# Altium schematic sheet YA-N-Power_Supply.SchDoc: Yet Another IoT Node - Power
size A4; Revision: 1.0; SheetNumber: 2; SheetTotal: 5
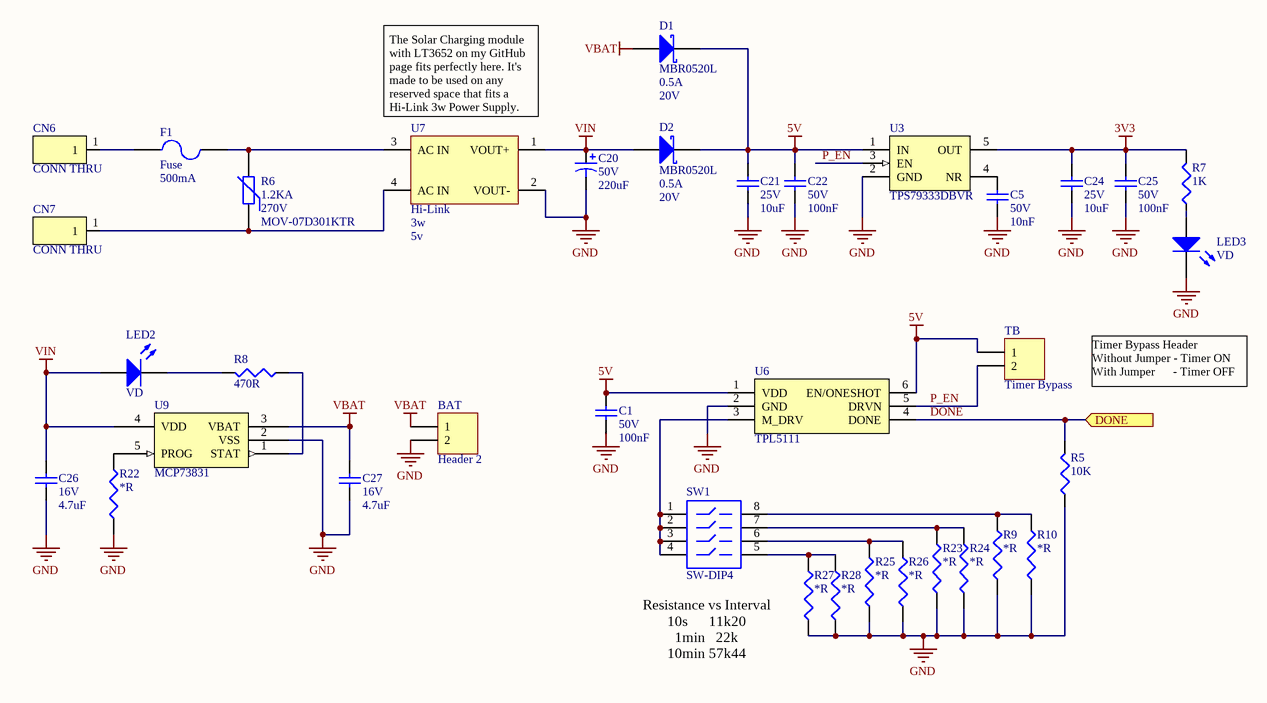
[diagram p0: YA-N-Power_Supply.SchDoc]

## Parts
BAT  Header 2  [CONN XH2.54 - 2]
C1  value 100nF  Tensão: 50V  [CC0603]  (hidden comment: Capacitor Cerâmico)
C5  value 10nF  Tensão: 50V  [CC0603]  (hidden comment: Capacitor Cerâmico)
C20  value 220uF  Tensão: 50V  [CPOLRAD10X20]  (hidden comment: Capacitor Aluminio)
C21  value 10uF  Tensão: 25V  [CC0805]  (hidden comment: Capacitor Cerâmico)
C22  value 100nF  Tensão: 50V  [CC0603]  (hidden comment: Capacitor Cerâmico)
C24  value 10uF  Tensão: 25V  [CC0805]  (hidden comment: Capacitor Cerâmico)
C25  value 100nF  Tensão: 50V  [CC0603]  (hidden comment: Capacitor Cerâmico)
C26  value 4.7uF  Tensão: 16V  [CC0805]  (hidden comment: Capacitor Cerâmico)
C27  value 4.7uF  Tensão: 16V  [CC0805]  (hidden comment: Capacitor Cerâmico)
CN6  CONN THRU  [CONN THRU]
CN7  CONN THRU  [CONN THRU]
D1  MBR0520L  Corrente: 0.5A  Tensão: 20V  [SOD-123F]
D2  MBR0520L  Corrente: 0.5A  Tensão: 20V  [SOD-123F]
F1  Fuse  Corrente: 500mA  [BLOCKFUS_4X8]
LED2  value VD  [LED 0603]  (hidden comment: LED)
LED3  value VD  [LED 0603]  (hidden comment: LED)
R5  value 10K  [CC0603]  (hidden comment: Resistor)
R6  value 270V  Corrente: 1.2KA  Obs: MOV-07D301KTR  [DISCFUS7]  (hidden comment: Varistor)
R7  value 1K  [CC0603]  (hidden comment: Resistor)
R8  value 470R  [CC0603]  (hidden comment: Resistor)
R9  value *R  [CC0603]  (hidden comment: Resistor)
R10  value *R  [CC0603]  (hidden comment: Resistor)
R22  value *R  [CC0603]  (hidden comment: Resistor)
R23  value *R  [CC0603]  (hidden comment: Resistor)
R24  value *R  [CC0603]  (hidden comment: Resistor)
R25  value *R  [CC0603]  (hidden comment: Resistor)
R26  value *R  [CC0603]  (hidden comment: Resistor)
R27  value *R  [CC0603]  (hidden comment: Resistor)
R28  value *R  [CC0603]  (hidden comment: Resistor)
SW1  SW-DIP4  [SWITCH-DIP8]
TB  Timer Bypass  [CONN HDR1X2]
U3  TPS79333DBVR  [SOT-23-5N]
U6  TPL5111  [TSOT-23-6N]
U7  Hi-Link  Potência: 3w  Tensão: 5v  [Fonte-HILINK]
U9  MCP73831  [SOT-23-5N]

## Ports
DONE (in)

## Nets
3V3: C24.2 C25.2 R7.2 U3.5(OUT)
5V: C1.2 C21.2 C22.2 D1.2(K) D2.2(K) TB.1 U3.1(IN) U6.1(VDD) U6.6(EN/ONESHOT)
GND: BAT.2 C1.1 C5.1 C20.2 C21.1 C22.1 C24.1 C25.1 C26.1 C27.1 LED3.2(K) R5.1 R9.1 R10.1 R22.1 R23.1 R24.1 R25.1 R26.1 R27.1 R28.1 U3.2(GND) U6.2(GND) U7.2(VOUT-) U9.2(VSS)
VBAT: BAT.1 C27.2 D1.1(A) U9.3(VBAT)
VIN: C20.1 C26.2 D2.1(A) LED2.1(A) U7.1(VOUT+) U9.4(VDD)
DONE: R5.2 U6.4(DONE) ; port DONE
P_EN: TB.2 U3.3(EN) U6.5(DRVN)
NetC5_2: C5.2 U3.4(NR)
NetCN6_1: CN6.1 F1.1
NetCN7_1: CN7.1 R6.1 U7.4(AC_IN)
NetF1_2: F1.2 R6.2 U7.3(AC_IN)
NetLED2_2: LED2.2(K) R8.2
NetLED3_1: LED3.1(A) R7.1
NetR8_1: R8.1 U9.1(STAT)
NetR9_2: R9.2 R10.2 SW1.8
NetR22_2: R22.2 U9.5(PROG)
NetR23_2: R23.2 R24.2 SW1.7
NetR25_2: R25.2 R26.2 SW1.6
NetR27_2: R27.2 R28.2 SW1.5
NetSW1_1: SW1.1 SW1.2 SW1.3 SW1.4 U6.3(M_DRV)

## Notes on the sheet
- (near U7) The Solar Charging module with LT3652 on my GitHub page fits perfectly here. It's made to be used on any reserved space that fits a Hi-Link 3w Power Supply.
- Timer Bypass Header
  Without Jumper - Timer ON
  With Jumper      - Timer OFF
- Resistance vs Interval
  10s      11k20
  1min   22k
  10min 57k44
- Projeto:
- Tamanho:
- Data:
- A4
- Eng. Felipe Navarro
- Hora:
- Revisão:
- Folha
- de
- Arquivo:

## Library data of the parts
BAT TB = Header 2: Header, 2-Pin; ChinesePrice: 0,10000; Chinês: Proved - Local; Value: Barra de 40 pinos - ATENÇÃO; Corrente: *; Potência: *; Supplier 1: Digi-Key; Supplier Part Number 1: A26509-40-ND; Tensão: *; Obs:: *; Tolerância: *; ComponentLink1Description: Datasheet; ComponentLink1URL: D:\Tecnoclade\Datasheet\!DataMissing.pdf
C1 C22 C25 = Cap 100nF 50V 0603 X7R: Capacitor (Semiconductor SIM Model); Chinês: Local; ChinesePrice: 0,00250; Corrente: *A; Potência: *W; Obs:: X7R; Tolerância: ±10%; Supplier 1: Digi-Key; Supplier Part Number 1: 1276-1000-1-ND; ComponentLink1Description: Datasheet; ComponentLink1URL: D:\Tecnoclade\Datasheet\!DataMissing.pdf
C5 = Cap 10nF 50V 0603 X7R 5%: Capacitor (Semiconductor SIM Model); Chinês: Local; ChinesePrice: 0,00320; Corrente: *A; Potência: *W; Obs:: X7R; Tolerância: ±5%; Supplier 1: Digi-Key; Supplier Part Number 1: 399-1092-1-ND; ComponentLink1Description: Datasheet; ComponentLink1URL: D:\Tecnoclade\Datasheet\!DataMissing.pdf
C20 = PCap 220uF 50V CPOLRAD10X20 LOESR: Polarized Capacitor; ChinesePrice: 0,00000; Chinês: -----; Corrente: 970mA (Ripple); Potência: *W; Obs: LOESR (0R19); Tolerância: ±20%; Supplier 1: Digi-Key; Supplier Part Number 1: 565-3452-ND; ComponentLink1Description: Datasheet; ComponentLink1URL: D:\Tecnoclade\Datasheet\Capacitor e_PZA.pdf
C21 C24 = Cap 10uF 25V 0805 X5R: Capacitor (Semiconductor SIM Model); Chinês: Local; ChinesePrice: 0,02620; Corrente: *A; Potência: *W; Obs:: X5R; Tolerância: ±10%; Supplier 1: Digi-Key; Supplier Part Number 1: 587-2985-1-ND; ComponentLink1Description: Datasheet; ComponentLink1URL: D:\Tecnoclade\Datasheet\!DataMissing.pdf
C26 C27 = Cap 4.7uF 16V 0805 X5R: Capacitor (Semiconductor SIM Model); Chinês: Local; ChinesePrice: 0,01480; Corrente: *A; Potência: *W; Obs:: X5R; Tolerância: ±10%; Supplier 1: Digi-Key; Supplier Part Number 1: 1276-1065-1-ND; ComponentLink1Description: Datasheet; ComponentLink1URL: D:\Tecnoclade\Datasheet\!DataMissing.pdf
CN6 CN7 = CONN THRU: Chinês: Proved - Local; Corrente: *; Potência: *; Supplier 1: Digi-Key; Supplier Part Number 1: --Not; Tensão: *; Obs:: *; Tolerância: *; ComponentLink1Description: Datasheet; ComponentLink1URL: D:\Tecnoclade\Datasheet\!DataMissing.pdf
D1 D2 = DS 20V 0.5A 385mV SOD-123: Schottky Diode; ChinesePrice: 0,00000; Chinês: ----; Value: Vf=385mV@500mA; Obs:: Fast Recovery =< 500ns, > 200mA (Io); Potência: *; Supplier 1: Digi-Key; Supplier Part Number 1: MBR0520L-TPMSCT-ND; Tolerância: *; ComponentLink1Description: Datasheet; ComponentLink1URL: D:\Tecnoclade\Datasheet\!DataMissing.pdf
F1 = Fuse Disc: ChinesePrice: 0,00000; Chinês: ----; Tensão: 250v; Potência: *; Supplier 1: Digi-Key; Supplier Part Number 1: 507-1173-ND; Value: *; Obs:: *; Tolerância: *; ComponentLink1Description: Datasheet; ComponentLink1URL: D:\Tecnoclade\Datasheet\
LED2 LED3 = LED 0603 VD 2V 75mW: ChinesePrice: 0,02810; Chinês: Local; Corrente: 20mA; Potência: 75mW; Tensão: 2V; Obs:: 35mcd@130º; Supplier 1: Digi-Key; Supplier Part Number 1: 160-1478-1-ND; Tolerância: *; ComponentLink1Description: Datasheet; ComponentLink1URL: D:\Tecnoclade\Datasheet\!DataMissing.pdf
R5 = Res 10K 1% 0603 1/10W: ChinesePrice: 0,00089; Chinês: Local; Corrente: *A; Potência: 1/10W; Tensão: *V; Tolerância: ±1%; Supplier 1: Digi-Key; Supplier Part Number 1: P10.0KHCT-ND; Obs: *; ComponentLink1Description: Datasheet; ComponentLink1URL: D:\Tecnoclade\Datasheet\!DataMissing.pdf
R6 = Var 270V 1.2KA Disc7mm: Varistor (Voltage-Sensitive Resistor); ChinesePrice: 0,00000; Chinês: ----; Potência: 20J; Tensão: 190Vac / 250Vdc; Tolerância: ±*%; Supplier 1: Digi-Key; Supplier Part Number 1: MOV-07D301KCT-ND; ComponentLink1Description: Datasheet; ComponentLink1URL: D:\Tecnoclade\Datasheet\!DataMissing.pdf
R7 = Res 1K 1% 0603 1/10W: ChinesePrice: 0,00089; Chinês: Local; Corrente: *A; Potência: 1/10W; Tensão: *V; Tolerância: ±1%; Supplier 1: Digi-Key; Supplier Part Number 1: RMCF0603FT1K00CT-ND; Obs: *; ComponentLink1Description: Datasheet; ComponentLink1URL: D:\Tecnoclade\Datasheet\!DataMissing.pdf
R8 = Res 470R 5% 0603 1/10W: ChinesePrice: 0,00000; Chinês: ----; Corrente: *A; Potência: 1/10W; Tensão: *V; Obs: ±200ppm/ºC; Tolerância: ±5%; Supplier 1: Digi-Key; Supplier Part Number 1: RMCF0603JT470RCT-ND; ComponentLink1Description: Datasheet; ComponentLink1URL: D:\Tecnoclade\Datasheet\!DataMissing.pdf
R9 R10 R22-R28 = Res - $Val $% $Footprint $Pot: ChinesePrice: 0,00000; Chinês: ----; Corrente: *A; Potência: 1/10W; Tensão: *V; Tolerância: ±*%; Supplier 1: Digi-Key; Supplier Part Number 1: --Del; Obs:: *; ComponentLink1Description: Datasheet; ComponentLink1URL: D:\Tecnoclade\Datasheet\!DataMissing.pdf
SW1 = SW-DIP4: 4009 Series DIP Switch, Raised actuator; Value: SPST; ChinesePrice: 0,00000; Chinês: ----; Corrente: *; Potência: *; Supplier 1: Digi-Key; Supplier Part Number 1: --Del; Tensão: *; Obs:: *; Tolerância: *; ComponentLink1Description: Datasheet; ComponentLink1URL: D:\Tecnoclade\Datasheet\
U3 = TPS79333: ULTRALOW-NOISE, HIGH PSRR, FAST RF 200mA LOW-DROPOUT LINEAR  REGULATORS I; Tensão: 3V3; ChinesePrice: 0,00000; Chinês: ----; Corrente: 200mA; Potência: *; Supplier 1: Digi-Key; Supplier Part Number 1: 296-12961-1-ND; Value: *; Obs:: *; Tolerância: *; ComponentLink1Description: Datasheet; ComponentLink1URL: D:\Tecnoclade\Datasheet\
U6 = TPL5111: Nano-Power System Timer for Power Gating; Chinês: Local; Corrente: *; Potência: *; Supplier 1: Digi-Key; Supplier Part Number 1: 296-42621-1-ND; Tensão: *; Obs:: *; Tolerância: *; ComponentLink1Description: Datasheet; ComponentLink1URL: D:\Tecnoclade\Datasheet\!DataMissing.pdf
U7 = Fonte Hi-Link: Fonte chaveada isolada; ChinesePrice: 0,00000; Chinês: ----; Corrente: 4; Supplier 1: Digi-Key; Value: *; Obs:: *; Tolerância: *; ComponentLink1Description: Datasheet; ComponentLink1URL: D:\Tecnoclade\Datasheet\IE1212S.pdf
U9 = MCP73832/1: Miniature Single-Cell, Fully Integrated Li-Ion, Li-Polymer Charge Management Controllers; ChinesePrice: 0,00000; Chinês: ----; Tensão: Vdd=3V75 ~ 6V; Value: Vchrg=4V2 ~ 4V5; Corrente: 500mA; Obs:: 73831=Tri-State / 73832=Open Drain; Potência: *; Supplier 1: Digi-Key; Supplier Part Number 1: MCP73831T-2ACI/OTCT-ND; Tolerância: *; Supplier 2: Digi-Key; ComponentLink1Description: Datasheet; ComponentLink1URL: D:\Tecnoclade\Datasheet\